# Altium schematic sheet yakimenko_power_control.SchDoc: =title_line_1 + title_line_2
size 840 x 594 mm; SheetNumber: n
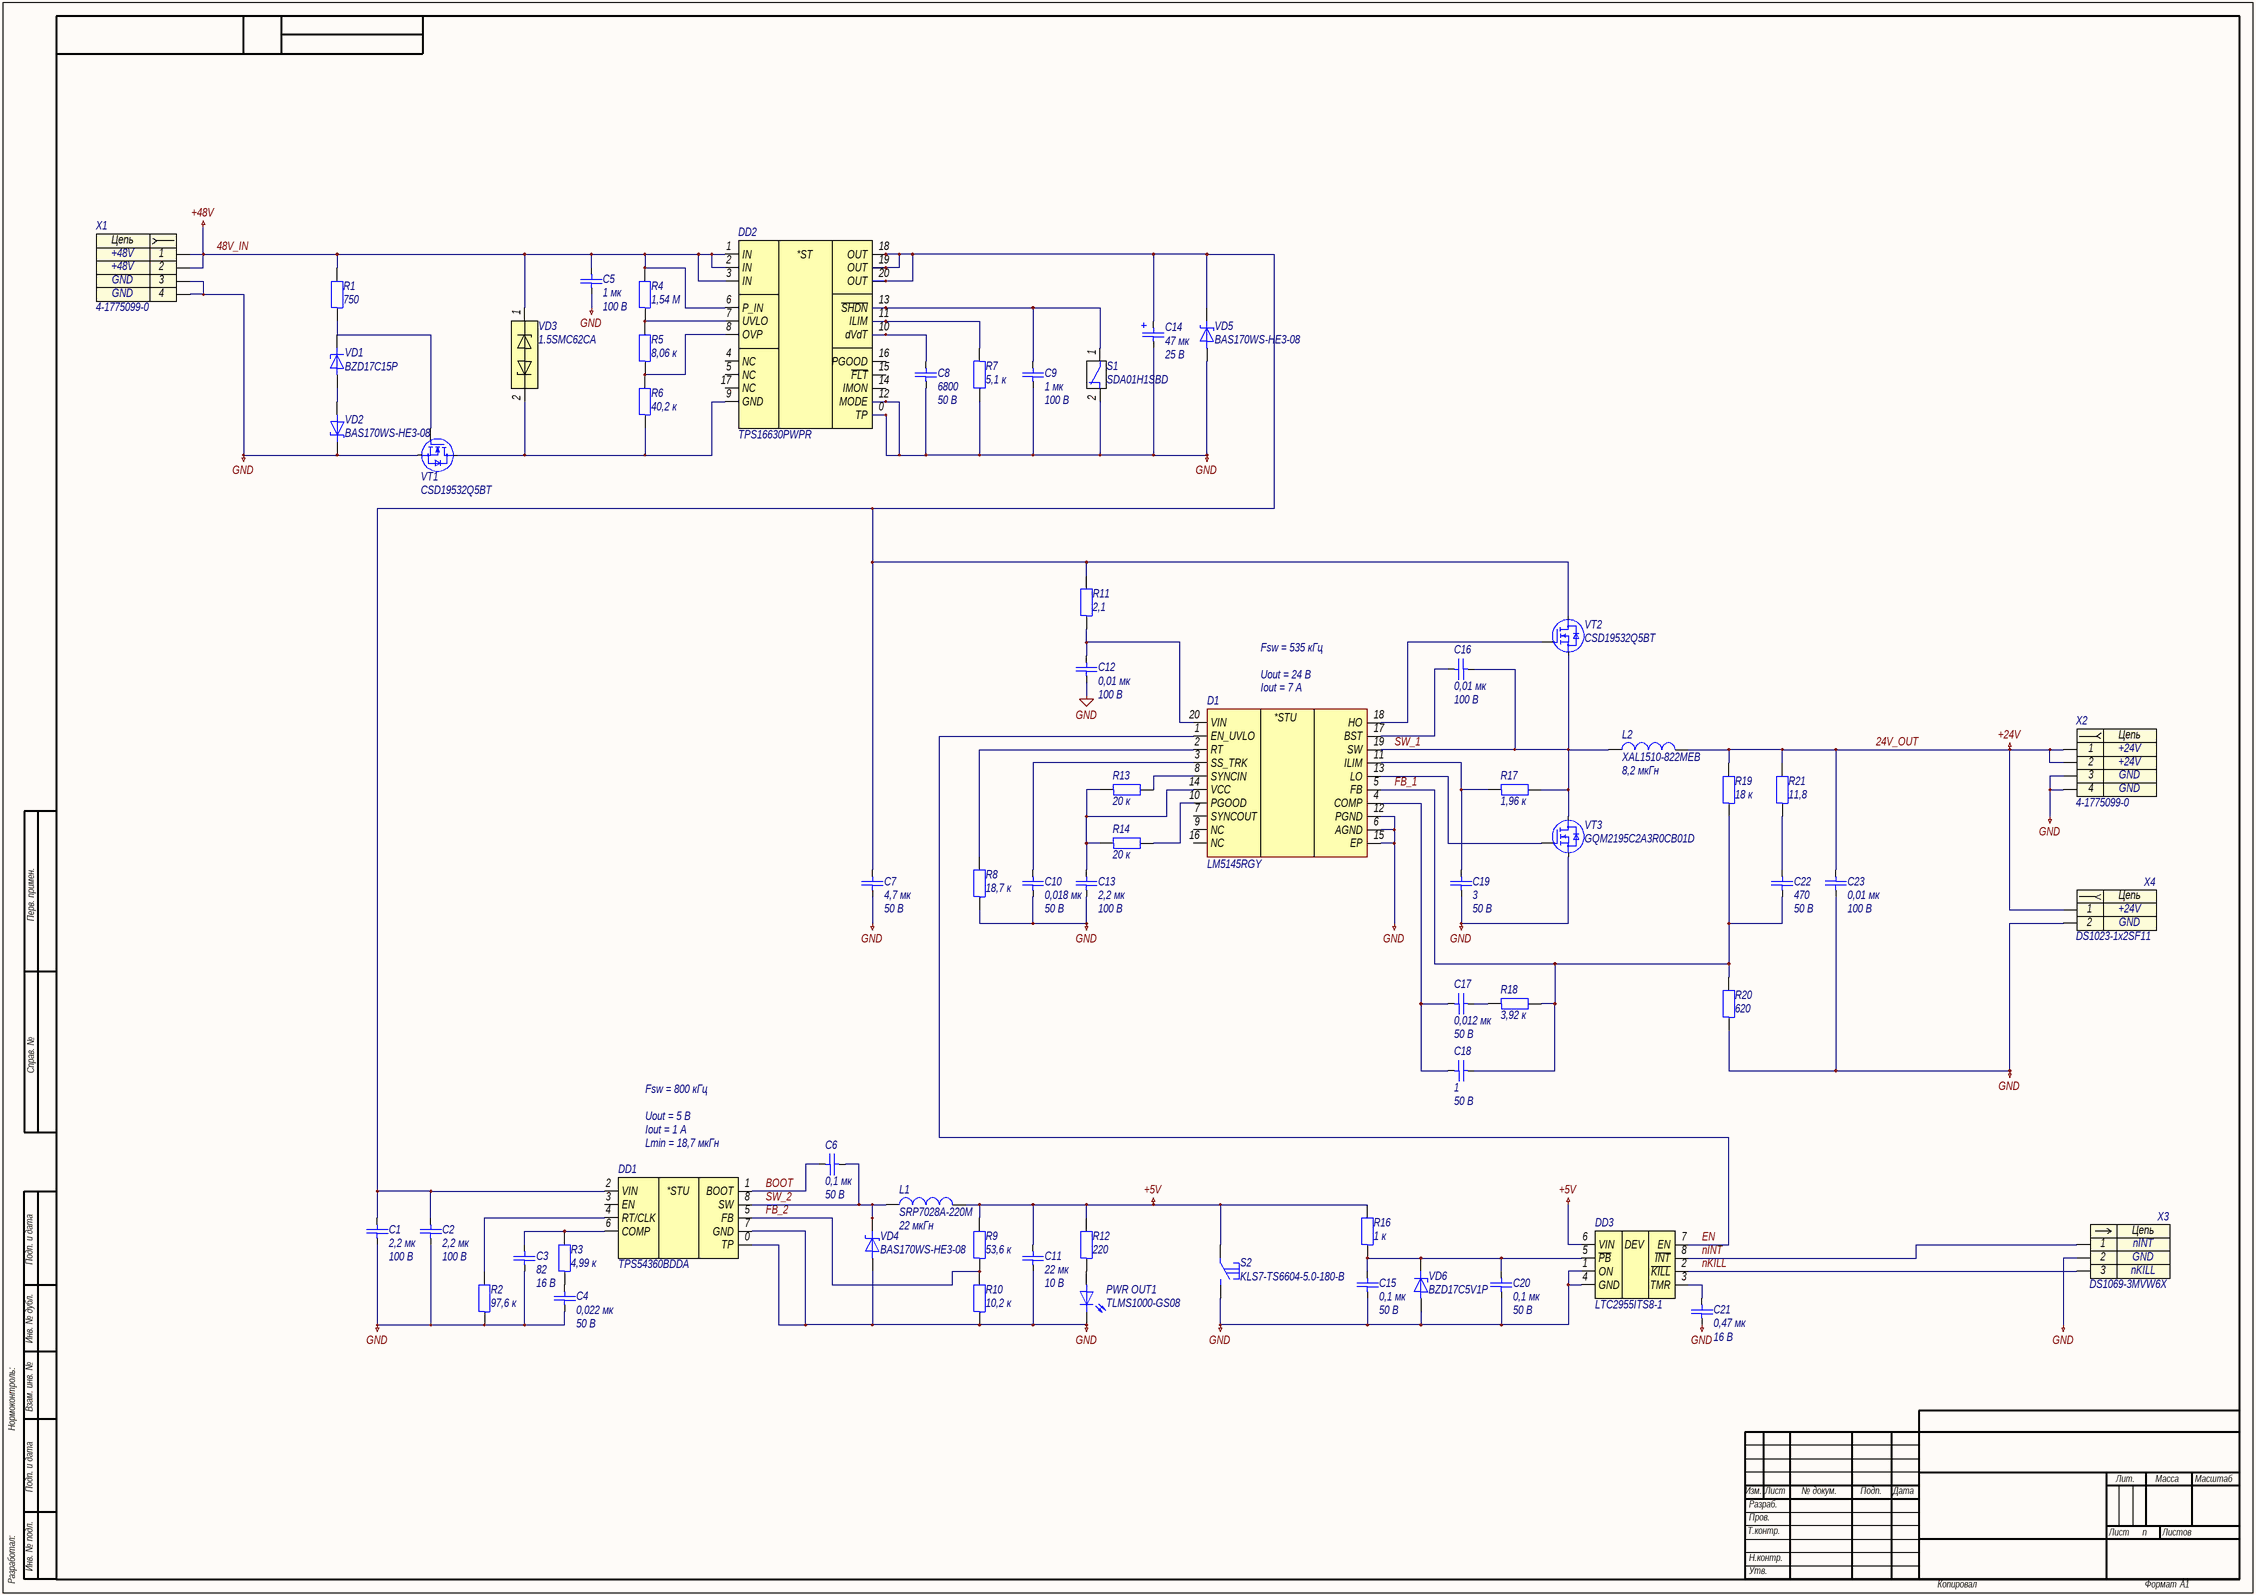
[diagram p0: yakimenko_power_control.SchDoc]

## Parts
C1  2,2 мк  Напряжение: 100 В  [C1206]
C2  2,2 мк  Напряжение: 100 В  [C1206]
C3  82  Напряжение: 16 В  [C0603]
C4  0,022 мк  Напряжение: 50 В  [C0603]
C5  1 мк  Напряжение: 100 В  [C1206]
C6  0,1 мк  Напряжение: 50 В  [C0402]
C7  4,7 мк  Напряжение: 50 В  [C0805]
C8  6800  Напряжение: 50 В  [C0402]
C9  1 мк  Напряжение: 100 В  [C1206]
C10  0,018 мк  Напряжение: 50 В  [C0603]
C11  22 мк  Напряжение: 10 В  [C0805]
C12  0,01 мк  Напряжение: 100 В  [C0603]
C13  2,2 мк  Напряжение: 100 В  [C1206]
C14  47 мк  Напряжение: 25 В  [C7343-31]
C15  0,1 мк  Напряжение: 50 В  [C0402]
C16  0,01 мк  Напряжение: 100 В  [C0603]
C17  0,012 мк  Напряжение: 50 В  [C0603]
C18  1  Напряжение: 50 В  [C0603]
C19  3  Напряжение: 50 В  [C0603]
C20  0,1 мк  Напряжение: 50 В  [C0402]
C21  0,47 мк  Напряжение: 16 В  [C0603]
C22  470  Напряжение: 50 В  [C0603]
C23  0,01 мк  Напряжение: 100 В  [C0603]
D1  LM5145RGY  [VQFN-20-P50-450X350X100-L40X25-T270X170]
DD1  TPS54360BDDA  [HSOIC-8-P127-490X390X170-L84X41-T310X240]
DD2  TPS16630PWPR  [HTSSOP-20-P65-650X440X120-L63X25-T296X296]
DD3  LTC2955ITS8-1  [SOT-23-8-P65-290X280X100]
L1  SRP7028A-220M  Индуктивность: 22 мкГн  [SRP-2-730X660X280]
L2  XAL1510-822MEB  Индуктивность: 8,2 мкГн  [XAL-2-1620X1520X1000]
PWR_OUT1  TLMS1000-GS08  [HL0603]
R1  750  [R0603]
R2  97,6 к  [R0603]
R3  4,99 к  [R0603]
R4  1,54 М  [R0603]
R5  8,06 к  [R0603]
R6  40,2 к  [R0603]
R7  5,1 к  [R0603]
R8  18,7 к  [R0603]
R9  53,6 к  [R0603]
R10  10,2 к  [R0603]
R11  2,1  [R0603]
R12  220  [R0603]
R13  20 к  [R0603]
R14  20 к  [R0603]
R16  1 к  [R0603]
R17  1,96 к  [R0603]
R18  3,92 к  [R0603]
R19  18 к  [R0603]
R20  620  [R0603]
R21  11,8  [R0603]
S1  SDA01H1SBD  [SDA01H1SBD]
S2  KLS7-TS6604-5.0-180-B  [KLS7-TS6604-5.0-180-B]
VD1  BZD17C15P  [DO-219AB-280X180X108]
VD2  BAS170WS-HE3-08  [SOD-123-268X130X115]
VD3  1.5SMC62CA  [DO-214AB-790X590X262]
VD4  BAS170WS-HE3-08  [SOD-123-268X130X115]
VD5  BAS170WS-HE3-08  [SOD-123-268X130X115]
VD6  BZD17C5V1P  [DO-219AB-280X180X108]
VT1  CSD19532Q5BT  [VSONP-8-P127-600X500X105]
VT2  CSD19532Q5BT  [VSONP-8-P127-600X500X105]
VT3  GQM2195C2A3R0CB01D  [VSONP-8-P127-600X500X105]
X1  4-1775099-0  [4-1775099-0]
X2  4-1775099-0  [4-1775099-0]
X3  DS1069-3MVW6X  [DS1069-3MVW6X]
X4  DS1023-1x2SF11  [DS1023-1X2SF11]

## Nets
24V_OUT: C23.2 L2.2 R19.2 R21.2 X2.1 X2.2 X4.1  [also labelled +24V]
48V_IN: C5.1 DD2.1(IN) DD2.2(IN) DD2.3(IN) DD2.6(P_IN) R1.2 R4.2 VD3.1 X1.1 X1.2  [also labelled +48V]
+5V: C11.1 DD3.6(VIN) L1.2 R9.2 R12.2 R16.2 S2.1
GND: C1.2 C2.2 C3.2 C4.2 C5.2 C7.2 C8.2 C9.2 C10.2 C11.2 C12.2 C13.2 C14.2 C15.2 C19.2 C20.2 C21.2 C23.1 D1.6(AGND) D1.12(PGND) D1.15(EP) DD1.0(TP) DD1.7(GND) DD2.0(TP) DD2.12(MODE) DD3.1(ON) DD3.4(GND) PWR_OUT1.1 R2.1 R7.2 R8.1 R10.1 R20.1 S1.2 S2.2 VD2.1 VD4.2 VD5.2 VD6.2 VT1.S VT3.S X1.3 X1.4 X2.3 X2.4 X3.2 X4.2
BOOT: C6.2 DD1.1(BOOT)
EN: D1.1(EN_UVLO) DD3.7(EN)
FB_1: C18.1 C22.2 D1.5(FB) R18.2 R19.1 R20.2
FB_2: DD1.5(FB) R9.1 R10.2
nINT: DD3.8(~{INT}) X3.1
nKILL: DD3.2(~{KILL}) X3.3
SW_1: C16.2 D1.19(SW) L2.1 R17.2 VT2.S VT3.D
SW_2: C6.1 DD1.8(SW) L1.1 VD4.1
NetC1_1: C1.1 C2.1 C7.1 C14.1 DD1.2(VIN) DD2.18(OUT) DD2.19(OUT) DD2.20(OUT) R11.2 VD5.1 VT2.D
NetC3_1: C3.1 DD1.6(COMP) R3.2
NetC4_1: C4.1 R3.1
NetC8_1: C8.1 DD2.10(dVdT)
NetC9_1: C9.1 DD2.13(~{SHDN}) S1.1
NetC10_1: C10.1 D1.3(SS_TRK)
NetC12_1: C12.1 D1.20(VIN) R11.1
NetC13_1: C13.1 D1.14(VCC) R13.1 R14.1
NetC15_1: C15.1 C20.1 DD3.5(~{PB}) R16.1 VD6.1
NetC16_1: C16.1 D1.17(BST)
NetC17_1: C17.1 R18.1
NetC17_2: C17.2 C18.2 D1.4(COMP)
NetC19_1: C19.1 D1.11(ILIM) R17.1
NetC21_1: C21.1 DD3.3(TMR)
NetC22_1: C22.1 R21.1
NetD1_2: D1.2(RT) R8.2
NetD1_8: D1.8(SYNCIN) R13.2
NetD1_10: D1.10(PGOOD) R14.2
NetD1_13: D1.13(LO) VT3.G
NetD1_18: D1.18(HO) VT2.G
NetDD1_4: DD1.4(RT/CLK) R2.2
NetDD2_7: DD2.7(UVLO) R4.1 R5.2
NetDD2_8: DD2.8(OVP) R5.1 R6.2
NetDD2_9: DD2.9(GND) R6.1 VD3.2 VT1.D
NetDD2_11: DD2.11(ILIM) R7.1
NetPWR_OUT1_2: PWR_OUT1.2 R12.1
NetR1_1: R1.1 VD1.1 VT1.G
NetVD1_2: VD1.2 VD2.2

Not connected (* = marked no-connect by the designer): D1 7(SYNCOUT) 9(NC) 16(NC); DD1 3(EN); DD2 4(NC) 5(NC) 14(IMON) 15(~{FLT}) 16(PGOOD) 17(NC)

## Notes on the sheet
- Fsw = 535 кГц
- Uout = 24 В
- (near D1) Iout = 7 А
- Fsw = 800 кГц
- Uout = 5 В
- Iout = 1 А
- Lmin = 18,7 мкГн
- Перв. примен.
- Справ. №
- Подп. и дата
- Инв. № дубл.
- Нормоконтроль:
- Взам. инв. №
- Изм.
- Лист
- № докум.
- Подп.
- Дата
- Лит.
- Масса
- Масштаб
- Т.контр.
- Пров.
- Разраб.
- Листов
- Разработал:
- Инв. № подл.
- Н.контр.
- Утв.
- Копировал
- Формат
- А1
- (in symbol dd0007) *ST; *STU
- (in symbol dd0008) DEV
- (in symbol LM5145RGY) *STU
- (in symbol x0006) Цепь
- (in symbol x0032) Цепь
- (in symbol x0043) Цепь

## Library data of the parts
C1 C2 C13 = c0131: =Описание; ID: c0131; Фамилия: Ларионов; Описание: Конденсатор керамический чип 1206 2,2 мкФ 100 В ±10 %; Наименование: CC1206KKX7R0BB225; Производитель: YAGEO Corp.; Отклонение: ±10 %; Рабочие температуры: от –55 °С до +125 °С; Температурный коэффициент емкости: X7R; Корпус: 1206; Номинал: 2,2 мк; Номинальное напряжение: 100 В; HelpURL: https://www.yageo.com/upload/media/product/productsearch/datasheet/mlcc/UPY-NP0X7R_MV_100-to-630V_22.pdf
C3 = c0026: =Описание; ID: c0026; Фамилия: Ларионов; Описание: Конденсатор керамический чип 0603 82 пФ 16 В ±5 %; Наименование: CC0603JRNPO7BN820; Производитель: YAGEO Corp.; Отклонение: ±5 %; Рабочие температуры: от –55 °С до +125 °С; Температурный коэффициент емкости: C0G; Корпус: 0603; Номинал: 82; Номинальное напряжение: 16 В; HelpURL: https://www.yageo.com/upload/media/product/productsearch/datasheet/mlcc/UPY-GP_NP0_16V-to-50V_18.pdf
C4 = c0071: =Описание; ID: c0071; Фамилия: Паньков; Описание: Конденсатор керамический чип 0603 22 нФ 50 В ±10 %; Наименование: CC0603KRX7R9BB223; Производитель: YAGEO Corp.; Отклонение: ±10 %; Рабочие температуры: от –55 °С до +125 °С; Температурный коэффициент емкости: X7R; Корпус: 0603; Номинал: 0,022 мк; Номинальное напряжение: 50 В; HelpURL: https://www.yageo.com/upload/media/product/productsearch/datasheet/mlcc/UPY-GPHC_X7R_6.3V-to-50V_20.pdf
C5 C9 = c0120: =Описание; ID: c0120; Фамилия: Ларионов; Описание: Конденсатор керамический чип 1206 1 мкФ 100 В ±10 %; Наименование: CC1206KKX7R0BB105; Производитель: YAGEO Corp.; Отклонение: ±10 %; Рабочие температуры: от –55 °С до +125 °С; Температурный коэффициент емкости: X7R; Корпус: 1206; Номинал: 1 мк; Номинальное напряжение: 100 В; HelpURL: https://www.yageo.com/upload/media/product/productsearch/datasheet/mlcc/UPY-NP0X7R_MV_100-to-630V_22.pdf
C6 C15 C20 = c0086: =Описание; ID: c0086; Фамилия: Паньков; Описание: Конденсатор керамический чип 0402 100 нФ 50 В ±10 %; Наименование: CC0402KRX5R9BB104; Производитель: YAGEO Corp.; Отклонение: ±10 %; Рабочие температуры: от –55 °С до +85 °С; Температурный коэффициент емкости: X5R; Корпус: 0402; Номинал: 0,1 мк; Номинальное напряжение: 50 В; HelpURL: https://www.yageo.com/upload/media/product/productsearch/datasheet/mlcc/UPY-GPHC_X5R_4V-to-50V_26.pdf
C7 = c0140: =Описание; ID: c0140; Фамилия: Паньков; Описание: Конденсатор керамический чип 0805 4,7 мкФ 50 В ±10 %; Наименование: CC0805KKX5R9BB475; Производитель: YAGEO Corp.; Отклонение: ±10 %; Рабочие температуры: от –55 °С до +85 °С; Температурный коэффициент емкости: X5R; Корпус: 0805; Номинал: 4,7 мк; Номинальное напряжение: 50 В; HelpURL: https://www.yageo.com/upload/media/product/productsearch/datasheet/mlcc/UPY-GPHC_X5R_4V-to-50V_26.pdf
C8 = c0008: =Описание; ID: c0008; Фамилия: Жернаков; Описание: Конденсатор керамический чип 0402 6,8 нФ 50 В ±5 %; Наименование: CL05B682JB5NNNC; Производитель: Samsung Electro-Mechanics; Отклонение: ±5 %; Рабочие температуры: от –55 °С до +125 °С; Температурный коэффициент емкости: X7R; Корпус: 0402; Номинал: 6800; Номинальное напряжение: 50 В; HelpURL: http://product.samsungsem.com/mlcc/CL05B682JB5NNN.do
C10 = c0064: =Описание; ID: c0064; Фамилия: Паньков; Описание: Конденсатор керамический чип 0603 18 нФ 50 В ±5 %; Наименование: CC0603JRX7R9BB183; Производитель: YAGEO Corp.; Отклонение: ±5 %; Рабочие температуры: от –55 °С до +125 °С; Температурный коэффициент емкости: X7R; Корпус: 0603; Номинал: 0,018 мк; Номинальное напряжение: 50 В; HelpURL: https://www.yageo.com/upload/media/product/productsearch/datasheet/mlcc/UPY-GPHC_X7R_6.3V-to-50V_20.pdf
C11 = c0158: =Описание; ID: c0158; Фамилия: Паньков; Описание: Конденсатор керамический чип 0805 22 мкФ 10 В ±20 %; Наименование: CC0805MKX5R6BB226; Производитель: YAGEO Corp.; Отклонение: ±20 %; Рабочие температуры: от –55 °С до +85 °С; Температурный коэффициент емкости: X5R; Корпус: 0805; Номинал: 22 мк; Номинальное напряжение: 10 В; HelpURL: https://www.yageo.com/upload/media/product/productsearch/datasheet/mlcc/UPY-GPHC_X5R_4V-to-50V_26.pdf
C12 C16 C23 = c0059: =Описание; ID: c0059; Фамилия: Ларионов; Описание: Конденсатор керамический чип 0603 10 нФ 100 В ±5 %; Наименование: CC0603JRX7R0BB103; Производитель: YAGEO Corp.; Отклонение: ±5 %; Рабочие температуры: от –55 °С до +125 °С; Температурный коэффициент емкости: X7R; Корпус: 0603; Номинал: 0,01 мк; Номинальное напряжение: 100 В; HelpURL: https://www.yageo.com/upload/media/product/productsearch/datasheet/mlcc/UPY-NP0X7R_MV_100-to-630V_22.pdf
C14 = c0127: =Описание; ID: c0127; Фамилия: Паньков; Описание: Конденсатор танталовый чип 7343-31 47 мкФ 25 В ±10 %; Наименование: 293D476X9025D2TE3; Производитель: Vishay Intertechnology, Inc.; Отклонение: ±10 %; Эквивалентное последовательное сопротивление: 0,7 Ом; Среднеквадратичный размах пульсации тока: 0,46 А; Рабочие температуры: от –55 °С до +125 °С; Корпус: 7343-31; Номинал: 47 мк; Номинальное напряжение: 25 В; HelpURL: https://www.vishay.com/capacitors/list/product-40002/
C17 = c0061: =Описание; ID: c0061; Фамилия: Паньков; Описание: Конденсатор керамический чип 0603 12 нФ 50 В ±5 %; Наименование: CC0603JRX7R9BB123; Производитель: YAGEO Corp.; Отклонение: ±5 %; Рабочие температуры: от –55 °С до +125 °С; Температурный коэффициент емкости: X7R; Корпус: 0603; Номинал: 0,012 мк; Номинальное напряжение: 50 В; HelpURL: https://www.yageo.com/upload/media/product/productsearch/datasheet/mlcc/UPY-GPHC_X7R_6.3V-to-50V_20.pdf
C18 = c0014: =Описание; ID: c0014; Фамилия: Паньков; Описание: Конденсатор керамический чип 0603 1 пФ 50 В ±0,1 пФ; Наименование: CC0603BRNPO9BN1R0; Производитель: YAGEO Corp.; Отклонение: ±0,1 пФ; Рабочие температуры: от –55 °С до +125 °С; Температурный коэффициент емкости: C0G; Корпус: 0603; Номинал: 1; Номинальное напряжение: 50 В; HelpURL: https://www.yageo.com/upload/media/product/productsearch/datasheet/mlcc/UPY-GP_NP0_16V-to-50V_18.pdf
C19 = c0016: =Описание; ID: c0016; Фамилия: Паньков; Описание: Конденсатор керамический чип 0603 3 пФ 50 В ±0,1 пФ; Наименование: CC0603BRNPO9BN3R0; Производитель: YAGEO Corp.; Отклонение: ±0,1 пФ; Рабочие температуры: от –55 °С до +125 °С; Температурный коэффициент емкости: C0G; Корпус: 0603; Номинал: 3; Номинальное напряжение: 50 В; HelpURL: https://www.yageo.com/upload/media/product/productsearch/datasheet/mlcc/UPY-GP_NP0_16V-to-50V_18.pdf
C21 = c0104: =Описание; ID: c0104; Фамилия: Паньков; Описание: Конденсатор керамический чип 0603 470 нФ 16 В ±10 %; Наименование: CC0603KRX5R7BB474; Производитель: YAGEO Corp.; Отклонение: ±10 %; Рабочие температуры: от –55 °С до +85 °С; Температурный коэффициент емкости: X5R; Корпус: 0603; Номинал: 0,47 мк; Номинальное напряжение: 16 В; HelpURL: https://www.yageo.com/upload/media/product/productsearch/datasheet/mlcc/UPY-GPHC_X5R_4V-to-50V_26.pdf
C22 = c0033: =Описание; ID: c0033; Фамилия: Паньков; Описание: Конденсатор керамический чип 0603 470 пФ 50 В ±1 %; Наименование: CC0603FRNPO9BN471; Производитель: YAGEO Corp.; Отклонение: ±1 %; Рабочие температуры: от –55 °С до +125 °С; Температурный коэффициент емкости: C0G; Корпус: 0603; Номинал: 470; Номинальное напряжение: 50 В; HelpURL: https://www.yageo.com/upload/media/product/productsearch/datasheet/mlcc/UPY-GP_NP0_16V-to-50V_18.pdf
DD1 = dd0007: =Описание; ID: dd0007; Фамилия: Жернаков; Описание: Понижающий преобразователь напряжения 4,5…60 В / 1…58,8 В и 3,5 А; Производитель: Texas Instruments Inc.; Входное напряжение: от 4,5 В до 60 В; Выходное напряжение: от 1,0 В до 58,8 В; Коммутируемый ток: до 3,5 А; Частота переключения: от 100 кГц до 2,5 МГц; Рабочие температуры: от –40 °С до +150 °С; Корпус: HSOIC-8; Наименование: TPS54360BDDA; HelpURL: https://www.ti.com/product/TPS54360B
DD2 = dd0007: =Описание; ID: dd0007; Фамилия: Жернаков; Описание: Защитная микросхема eFuse 60 В и 6 А; Производитель: Texas Instruments Inc.; Напряжение: от 4,5 В до 60 В; Максимальное напряжение: 67 В; Ток: от 0,6 А до 6 А; Рабочие температуры: от –40 °С до +125 °С; Корпус: HTSSOP-20; Наименование: TPS16630PWPR; HelpURL: https://www.ti.com/product/TPS1663
DD3 = dd0008: =Описание; ID: dd0008; Фамилия: Жернаков; Описание: Контроллер включения/выключения; Производитель: Analog Devices, Inc.; Напряжение: от 1,5 В до 36 В; Максимальное напряжение: 36 В; Ток: —; Рабочие температуры: от –40 °С до +85 °С; Корпус: SOT-23-8; Наименование: LTC2955ITS8-1#TRMPBF; HelpURL: https://www.analog.com/en/products/ltc2955.html
L1 = l0013: =Описание; ID: l0013; Фамилия: Ларионов; Описание: Катушка индуктивности 22 мкГн ±20 %; Производитель: Bourns, Inc.; Отклонение: ±20 %; Номинальное активное сопротивление: 165 мОм; Максимальное активное сопротивление: 190 мОм; Резонансная частота: 10 МГц; Номинальный ток (при нагреве на 20 °С/40 °С): 2 А; Ток насыщения: 3,5 А; Рабочее напряжение: не указано; Рабочие температуры: от –55 °С до +150 °С; Корпус: 7,3 x 6,6 x 2,8; Наименование: SRP7028A-220M; Номинал: 22 мкГн; HelpURL: https://www.bourns.com/products/magnetic-products/power-inductors-aec-q200-compliant/product/SRP7028A
L2 = l0005: =Описание; ID: l0005; Фамилия: Паньков; Описание: Катушка индуктивности 8,2 мкГн ±20 %; Производитель: Coilcraft, Inc.; Отклонение: ±20 %; Номинальное активное сопротивление: 6 мОм; Максимальное активное сопротивление: 7,5 мОм; Резонансная частота: 10,8 МГц; Номинальный ток (при нагреве на 20 °С/40 °С): 18 А; Ток насыщения: 30 А; Рабочее напряжение: от 0 В до 60 В; Рабочие температуры: от –40 °С до +125 °С; Корпус: 16,2 x 15,2 x 10; Наименование: XAL1510-822MEB; Номинал: 8,2 мкГн; HelpURL: https://www.coilcraft.com/en-us/products/power/shielded-inductors/molded-inductor/xal/xal1510
PWR_OUT1 = hl0001: =Описание; ID: hl0001; Фамилия: Ларионов; Описание: Светодиод чип 0603 красный; Производитель: Vishay Intertechnology, Inc.; Цвет: Red; Номинальная сила света: 4 мкд; Номинальная длина волны: 628 нм; Номинальный прямой ток: 15 мА; Номинальное падение напряжения: 1,8 В; Рассеиваемая мощность: 40 мВт; Рабочие температуры: от -40 °С до +100 °С; Корпус: 0603; Наименование: TLMS1000-GS08; HelpURL: https://www.vishay.com/leds/list/product-83172/
R1 = r0028: =Описание; ID: r0028; Фамилия: Паньков; Описание: Резистор чип 0603 750 Ом ±1 % 0,1 Вт; Наименование: RC0603FR-07750RL; Производитель: YAGEO Corp.; Отклонение: ±1 %; Номинальное напряжение: 75 В; Рабочие температуры: от –55 °С до +155 °С; Номинальный ток: 1 А; Корпус: 0603; Номинал: 750; HelpURL: https://www.yageo.com/upload/media/product/productsearch/datasheet/rchip/PYu-RC_Group_51_RoHS_L_11.pdf
R2 = r0029: =Описание; ID: r0029; Фамилия: Водорезов; Описание: Резистор чип 0603 97,6 кОм ±1 % 0,1 Вт; Наименование: RC0603FR-0797K6L; Производитель: YAGEO Corp.; Отклонение: ±1 %; Номинальное напряжение: 75 В; Рабочие температуры: от -55 °С до +155 °С; Номинальный ток: 1 А; Корпус: 0603; Номинал: 97,6 к; HelpURL: https://www.yageo.com/upload/media/product/productsearch/datasheet/rchip/PYu-RC_Group_51_RoHS_L_11.pdf
R3 = r0017: =Описание; ID: r0017; Фамилия: Жернаков; Описание: Резистор чип 0603 4,99 кОм ±1 % 0,1 Вт; Наименование: RC0603FR-074K99L; Производитель: YAGEO Corp.; Отклонение: ±1 %; Номинальное напряжение: 75 В; Рабочие температуры: от -55 °С до +155 °С; Номинальный ток: 1 А; Корпус: 0603; Номинал: 4,99 к; HelpURL: https://www.yageo.com/upload/media/product/productsearch/datasheet/rchip/PYu-RC_Group_51_RoHS_L_11.pdf
R4 = r0042: =Описание; ID: r0042; Фамилия: Жернаков; Описание: Резистор чип 0603 1,54 МОм ±1 % 0,1 Вт; Наименование: RC0603FR-071M54L; Производитель: YAGEO Corp.; Отклонение: ±1 %; Номинальное напряжение: 75 В; Рабочие температуры: от -55 °С до +155 °С; Номинальный ток: 1 А; Корпус: 0603; Номинал: 1,54 М; HelpURL: https://www.yageo.com/upload/media/product/productsearch/datasheet/rchip/PYu-RC_Group_51_RoHS_L_11.pdf
R5 = r0020: =Описание; ID: r0020; Фамилия: Жернаков; Описание: Резистор чип 0603 8,06 кОм ±1 % 0,1 Вт; Наименование: RC0603FR-078K06L; Производитель: YAGEO Corp.; Отклонение: ±1 %; Номинальное напряжение: 75 В; Рабочие температуры: от -55 °С до +155 °С; Номинальный ток: 1 А; Корпус: 0603; Номинал: 8,06 к; HelpURL: https://www.yageo.com/upload/media/product/productsearch/datasheet/rchip/PYu-RC_Group_51_RoHS_L_11.pdf
R6 = r0028: =Описание; ID: r0028; Фамилия: Жернаков; Описание: Резистор чип 0603 40,2 кОм ±1 % 0,1 Вт; Наименование: RC0603FR-0740K2L; Производитель: YAGEO Corp.; Отклонение: ±1 %; Номинальное напряжение: 75 В; Рабочие температуры: от -55 °С до +155 °С; Номинальный ток: 1 А; Корпус: 0603; Номинал: 40,2 к; HelpURL: https://www.yageo.com/upload/media/product/productsearch/datasheet/rchip/PYu-RC_Group_51_RoHS_L_11.pdf
R7 = r0019: =Описание; ID: r0019; Фамилия: Жернаков; Описание: Резистор чип 0603 5,1 кОм ±1 % 0,1 Вт; Наименование: RC0603FR-075K1L; Производитель: YAGEO Corp.; Отклонение: ±1 %; Номинальное напряжение: 75 В; Рабочие температуры: от -55 °С до +155 °С; Номинальный ток: 1 А; Корпус: 0603; Номинал: 5,1 к; HelpURL: https://www.yageo.com/upload/media/product/productsearch/datasheet/rchip/PYu-RC_Group_51_RoHS_L_11.pdf
R8 R19 = r0113: =Описание; ID: r0113; Фамилия: Паньков; Описание: Резистор чип 0603 18 кОм ±1 % 0,1 Вт; Наименование: RC0603FR-0718KL; Производитель: YAGEO Corp.; Отклонение: ±1 %; Номинальное напряжение: 75 В; Номинальный ток: 1 А; Рабочие температуры: от –55 °С до +155 °С; Корпус: 0603; Примечание: Ряд E24; HelpURL: https://www.yageo.com/upload/media/product/productsearch/datasheet/rchip/PYu-RC_Group_51_RoHS_L_11.pdf
  R8: Номинал: 18,7 к
  R19: Номинал: 18 к
R9 = r0017: =Описание; ID: r0017; Фамилия: Жернаков; Описание: Резистор чип 0603 53,6 кОм ±0,1 % 0,1 Вт; Наименование: RC0603BR-0753K6L; Производитель: YAGEO Corp.; Отклонение: ±0,1 %; Номинальное напряжение: 75 В; Рабочие температуры: от -55 °С до +155 °С; Номинальный ток: 1 А; Корпус: 0603; Номинал: 53,6 к; HelpURL: https://www.yageo.com/upload/media/product/productsearch/datasheet/rchip/PYu-RC_Group_51_RoHS_L_11.pdf
R10 = r0014: =Описание; ID: r0014; Фамилия: Жернаков; Описание: Резистор чип 0603 10,2 кОм ±1 % 0,1 Вт; Наименование: RC0603FR-0710K2L; Производитель: YAGEO Corp.; Отклонение: ±1 %; Номинальное напряжение: 75 В; Рабочие температуры: от -55 °С до +155 °С; Номинальный ток: 1 А; Корпус: 0603; Номинал: 10,2 к; HelpURL: https://www.yageo.com/upload/media/product/productsearch/datasheet/rchip/PYu-RC_Group_51_RoHS_L_11.pdf
R11 = r0011: =Описание; ID: r0011; Фамилия: Ларионов; Описание: Резистор чип 0603 2,2 Ом ±1 % 0,1 Вт; Наименование: RC0603FR-072R2L; Производитель: YAGEO Corp.; Отклонение: ±1 %; Номинальное напряжение: 75 В; Номинальный ток: 1 А; Рабочие температуры: от –55 °С до +155 °С; Корпус: 0603; Примечание: Ряд E24; Номинал: 2,1; HelpURL: https://www.yageo.com/upload/media/product/productsearch/datasheet/rchip/PYu-RC_Group_51_RoHS_L_11.pdf
R12 = r0009: =Описание; ID: r0009; Фамилия: Ларионов; Описание: Резистор чип 0603 220 Ом ±1 % 0,1 Вт; Наименование: RC0603FR-07220RL; Производитель: YAGEO Corp.; Отклонение: ±1 %; Номинальное напряжение: 75 В; Рабочие температуры: от -55 °С до +155 °С; Номинальный ток: 1 А; Корпус: 0603; Номинал: 220; HelpURL: https://www.yageo.com/upload/media/product/productsearch/datasheet/rchip/PYu-RC_Group_51_RoHS_L_11.pdf
R13 R14 = r0115: =Описание; ID: r0115; Фамилия: Паньков; Описание: Резистор чип 0603 20 кОм ±1 % 0,1 Вт; Наименование: RC0603FR-0720KL; Производитель: YAGEO Corp.; Отклонение: ±1 %; Номинальное напряжение: 75 В; Номинальный ток: 1 А; Рабочие температуры: от –55 °С до +155 °С; Корпус: 0603; Примечание: Ряд E24; Номинал: 20 к; HelpURL: https://www.yageo.com/upload/media/product/productsearch/datasheet/rchip/PYu-RC_Group_51_RoHS_L_11.pdf
R16 = r0076: =Описание; ID: r0076; Фамилия: Ларионов; Описание: Резистор чип 0603 1 кОм ±1 % 0,1 Вт; Наименование: RC0603FR-071KL; Производитель: YAGEO Corp.; Отклонение: ±1 %; Номинальное напряжение: 75 В; Номинальный ток: 1 А; Рабочие температуры: от –55 °С до +155 °С; Корпус: 0603; Примечание: Ряд E24; Номинал: 1 к; HelpURL: https://www.yageo.com/upload/media/product/productsearch/datasheet/rchip/PYu-RC_Group_51_RoHS_L_11.pdf
R17 = r0084: =Описание; ID: r0084; Фамилия: Ларионов; Описание: Резистор чип 0603 2 кОм ±1 % 0,1 Вт; Наименование: RC0603FR-072KL; Производитель: YAGEO Corp.; Отклонение: ±1 %; Номинальное напряжение: 75 В; Номинальный ток: 1 А; Рабочие температуры: от –55 °С до +155 °С; Корпус: 0603; Примечание: Ряд E24; Номинал: 1,96 к; HelpURL: https://www.yageo.com/upload/media/product/productsearch/datasheet/rchip/PYu-RC_Group_51_RoHS_L_11.pdf
R18 = r0091: =Описание; ID: r0091; Фамилия: Паньков; Описание: Резистор чип 0603 3,9 кОм ±1 % 0,1 Вт; Наименование: RC0603FR-073K9L; Производитель: YAGEO Corp.; Номинал: 3,9 к; Отклонение: ±1 %; Номинальное напряжение: 75 В; Номинальный ток: 1 А; Рабочие температуры: от –55 °С до +155 °С; Корпус: 0603; Примечание: Ряд E24; HelpURL: https://www.yageo.com/upload/media/product/productsearch/datasheet/rchip/PYu-RC_Group_51_RoHS_L_11.pdf
R20 = r0071: =Описание; ID: r0071; Фамилия: Паньков; Описание: Резистор чип 0603 620 Ом ±1 % 0,1 Вт; Наименование: RC0603FR-07620RL; Производитель: YAGEO Corp.; Отклонение: ±1 %; Номинальное напряжение: 75 В; Номинальный ток: 1 А; Рабочие температуры: от –55 °С до +155 °С; Корпус: 0603; Примечание: Ряд E24; Номинал: 620; HelpURL: https://www.yageo.com/upload/media/product/productsearch/datasheet/rchip/PYu-RC_Group_51_RoHS_L_11.pdf
R21 = r0029: =Описание; ID: r0029; Фамилия: Паньков; Описание: Резистор чип 0603 12 Ом ±1 % 0,1 Вт; Наименование: RC0603FR-0712RL; Производитель: YAGEO Corp.; Номинал: 12; Отклонение: ±1 %; Номинальное напряжение: 75 В; Номинальный ток: 1 А; Рабочие температуры: от –55 °С до +155 °С; Корпус: 0603; Примечание: Ряд E24; HelpURL: https://www.yageo.com/upload/media/product/productsearch/datasheet/rchip/PYu-RC_Group_51_RoHS_L_11.pdf
S1 = s0005: =Описание; ID: s0005; Фамилия: Паньков; Описание: 2-х позиционный движковый переключатель; Производитель: C&K; Ток нагрузки: 100 мА @ 5 В; Сопротивление контакта: 50 мОм; Количество контактов: 2; Рабочие температуры: от –40 °С до +85 °С; Промывка: Запрещена; Корпус: 4,52 х 9,30 х 5,45; Наименование: SDA01H1SBD; HelpURL: https://www.ckswitches.com/products/switches/product-details/DIP/SDA/SDA01H1SBD/
S2 = s0002: =Описание; ID: s0002; Фамилия: Паньков; Описание: Тактовая кнопка поверхностного монтажа; Производитель: Ningbo KLS Electronic Co., Ltd.; Ток нагрузки: 50 мА @ 12 В; Сопротивление контакта: 50 мОм; Количество контактов: 4; Рабочие температуры: от –20 °С до +70 °С; Промывка: Запрещена; Корпус: 6,00 x 6,00 x 5,00; Наименование: KLS7-TS6604-5.0-180-B; HelpURL: http://www.klsele.com/products/Switches/Tact-Switches-Series/939.html
VD1 = vd0016: =Описание; ID: vd0016; Фамилия: Жернаков; Описание: Стабилитрон 15 В; Производитель: Vishay Intertechnology, Inc.; Номинальное напряжение стабилизации: 15 В; Разброс напряжения стабилизации: 13,8...15,6 В; Номинальный ток стабилизации: 50 мА; Рабочие температуры: от –55 °С до +150 °С; Корпус: DO-219AB; Наименование: BZD17C15P; HelpURL: https://www.vishay.com/product?docid=85161
VD2 VD4 VD5 = vd0006: =Описание; ID: vd0006; Фамилия: Ларионов; Описание: Диод Шоттки 70 В 0,07 А; Производитель: Vishay Intertechnology, Inc.; Максимальное прямое напряжение: 0,75 В; Максимальное обратное напряжение: 70 В; Максимальный прямой ток: 0,07 А; Рабочие температуры: от –55 °С до +125 °С; Корпус: SOD-123; Наименование: BAS170WS-HE3-08; HelpURL: https://www.vishay.com/diodes/list/product-85653/
VD3 = vd0009: =Описание; ID: vd0009; Фамилия: Ларионов; Описание: Двунаправленная диодная сборка для подавления помех 53 В; Производитель: Littelfuse, Inc.; Корпус: DO-214AB; Наименование: 1.5SMC62CA; HelpURL: https://www.littelfuse.com/products/tvs-diodes/surface-mount/1_5smc.aspx
VD6 = vd0005: =Описание; ID: vd0005; Фамилия: Паньков; Описание: Стабилитрон 5,1 В; Производитель: Vishay Intertechnology, Inc.; Номинальное напряжение стабилизации: 5,1 В; Разброс напряжения стабилизации: 4,8...5,4 В; Номинальный ток стабилизации: 100 мА; Рабочие температуры: от –55 °С до +150 °С; Корпус: DO-219AB; Наименование: BZD17C5V1P; HelpURL: https://www.vishay.com/product?docid=85161
VT1 VT2 = vt0005: =Описание; ID: vt0005; Фамилия: Жернаков; Описание: Полевой N-канальный МДП-транзистор 100 В 17 А; Производитель: Texas Instruments Inc.; Напряжение затвор — исток: ±20 В; Напряжение сток — исток: 100 В; Ток стока: 17 А; Сопротивление сток — исток: 5,7 мОм; Рабочие температуры: от –55 °С до +150 °С; Корпус: SON-8; Наименование: CSD19532Q5BT; HelpURL: https://www.ti.com/product/CSD19532Q5B
VT3 = vt0005: =Описание; ID: vt0005; Фамилия: Жернаков; Описание: Полевой N-канальный МДП-транзистор 100 В 17 А; Наименование: CSD19532Q5BT; Производитель: Texas Instruments Inc.; Напряжение затвор — исток: ±20 В; Напряжение сток — исток: 80 В; Ток стока: 17 А; Сопротивление сток — исток: 5,7 мОм; Рабочие температуры: от –55 °С до +150 °С; Корпус: SON-8; HelpURL: https://www.ti.com/product/CSD19532Q5B
X1 = x0006: =Описание; Contact_1: +48V; Contact_3: GND; ID: x0006; Фамилия: Ларионов; Описание: ATX Power 4 pin гнездо прямой; Производитель: TE Connectivity; Contact_2: +48V; Contact_4: GND; Наименование: 4-1775099-0; HelpURL: https://www.te.com/usa-en/product-4-1775099-0.html
X2 = x0006: =Описание; Contact_1: +24V; Contact_3: GND; ID: x0006; Фамилия: Ларионов; Описание: ATX Power 4 pin гнездо прямой; Производитель: TE Connectivity; Contact_2: +24V; Contact_4: GND; Наименование: 4-1775099-0; HelpURL: https://www.te.com/usa-en/product-4-1775099-0.html
X3 = x0043: =Описание; Contact_1: nINT; Contact_2: GND; Contact_3: nKILL; ID: x0043; Фамилия: Паньков; Описание: CWF 3 pin 2,5 мм вилка прямой; Производитель: Connfly Electronic Co., Ltd.; Наименование: DS1069-3MVW6X; HelpURL: http://en.connfly.group/product/xVkr=EusQssAN0gN=Aos=mU+UrVkR9kqEAN0gN0MUR+g+NB+A
X4 = x0032: =Описание; Contact_1: +24V; Contact_2: GND; ID: x0032; Фамилия: Паньков; Описание: PBS 2 pin 2,54 мм гнездо прямой; Производитель: Connfly Electronic Co., Ltd.; Наименование: DS1023-1x2SF11; HelpURL: http://en.connfly.group/product/xVkr=EusQssAN0gN=Aos=mU+UrVkR9kqEAN0gN0AUCUNB+A